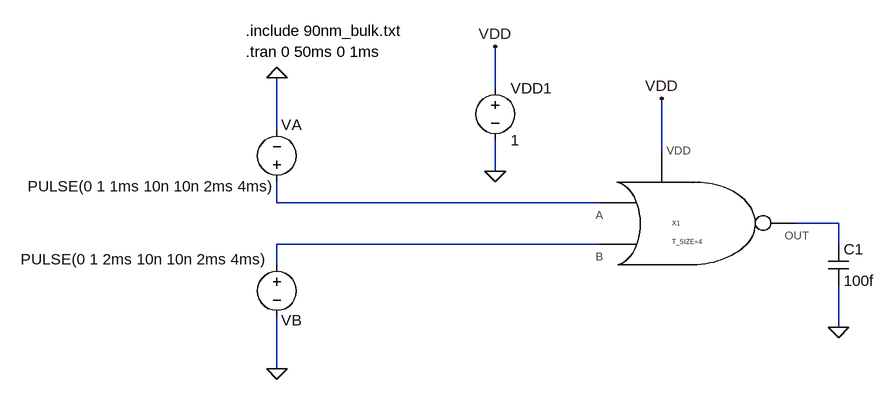
[diagram p0: schematic testing_cmos_nor.asc]
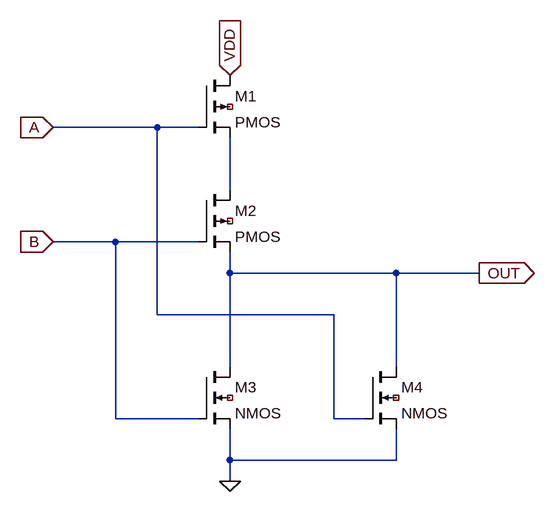
[diagram p1: sub-circuit cmos_nor.asc]
testing_cmos_nor.asc, the LTspice schematic file:
Version 4
SHEET 1 908 680
WIRE -48 -48 -48 -112
WIRE -384 16 -384 -64
WIRE 208 48 208 -32
WIRE -48 80 -48 32
WIRE -384 128 -384 96
WIRE 112 128 -384 128
WIRE 480 160 416 160
WIRE 112 192 -384 192
WIRE 480 192 480 160
WIRE -384 224 -384 192
WIRE 480 320 480 256
WIRE -384 384 -384 304
FLAG 208 -32 VDD
FLAG 480 320 0
FLAG -48 80 0
FLAG -48 -112 VDD
FLAG -384 -64 0
FLAG -384 384 0
SYMBOL cmos_nor 224 160 R0
WINDOW 0 0 0 Left 0
WINDOW 39 0 28 Left 0
SYMATTR InstName X1
SYMATTR SpiceLine T_SIZE=4
SYMBOL voltage -384 208 R0
WINDOW 123 0 0 Left 0
WINDOW 39 0 0 Left 0
WINDOW 0 7 101 Left 2
WINDOW 3 -394 7 Left 2
SYMATTR InstName VB
SYMATTR Value PULSE(0 1 2ms 10n 10n 2ms 4ms)
SYMBOL voltage -384 112 R180
WINDOW 0 -38 104 Left 2
WINDOW 3 3 9 Left 2
WINDOW 123 0 0 Left 0
WINDOW 39 0 0 Left 0
SYMATTR InstName VA
SYMATTR Value PULSE(0 1 1ms 10n 10n 2ms 4ms)
SYMBOL cap 464 192 R0
SYMATTR InstName C1
SYMATTR Value 100f
SYMBOL voltage -48 -64 R0
WINDOW 123 0 0 Left 0
WINDOW 39 0 0 Left 0
SYMATTR InstName VDD1
SYMATTR Value 1
TEXT -432 -136 Left 2 !.include 90nm_bulk.txt
TEXT -432 -104 Left 2 !.tran 0 50ms 0 1ms

cmos_nor.asc, the sub-circuit schematic file:
Version 4
SHEET 1 880 788
WIRE -1744 224 -1904 224
WIRE -1680 224 -1744 224
WIRE -1632 320 -1632 240
WIRE -1808 400 -1904 400
WIRE -1680 400 -1808 400
WIRE -1632 448 -1632 416
WIRE -1376 448 -1632 448
WIRE -1248 448 -1376 448
WIRE -1744 512 -1744 224
WIRE -1472 512 -1744 512
WIRE -1632 592 -1632 448
WIRE -1376 592 -1376 448
WIRE -1808 672 -1808 400
WIRE -1680 672 -1808 672
WIRE -1472 672 -1472 512
WIRE -1424 672 -1472 672
WIRE -1632 736 -1632 688
WIRE -1376 736 -1376 688
WIRE -1376 736 -1632 736
WIRE -1632 768 -1632 736
FLAG -1632 144 VDD
IOPIN -1632 144 In
FLAG -1904 224 A
IOPIN -1904 224 In
FLAG -1904 400 B
IOPIN -1904 400 In
FLAG -1248 448 OUT
IOPIN -1248 448 Out
FLAG -1632 768 0
SYMBOL pmos4 -1680 320 R0
SYMATTR InstName M2
SYMBOL pmos4 -1680 144 R0
SYMATTR InstName M1
SYMBOL nmos4 -1680 592 R0
SYMATTR InstName M3
SYMBOL nmos4 -1424 592 R0
SYMATTR InstName M4

The netlist it stands for:
* testing_cmos_nor.asc
XX1 N002 VDD N001 N003 cmos_nor params: T_SIZE=4
VB N003 0 PULSE(0 1 2ms 10n 10n 2ms 4ms)
VA N001 0 PULSE(0 1 1ms 10n 10n 2ms 4ms)
C1 N002 0 100f
VDD1 VDD 0 1

* block symbol definitions
.subckt cmos_nor OUT VDD A B
M2 N001 B OUT NC_01 PMOS
M1 VDD A N001 NC_02 PMOS
M3 OUT B 0 NC_03 NMOS
M4 OUT A 0 NC_04 NMOS
.ends cmos_nor

.model NMOS NMOS
.model PMOS PMOS
.lib standard.mos
.include 90nm_bulk.txt
.tran 0 50ms 0 1ms
.backanno
.end